# EAGLE design Control Board (EAGLE 9.1.0)
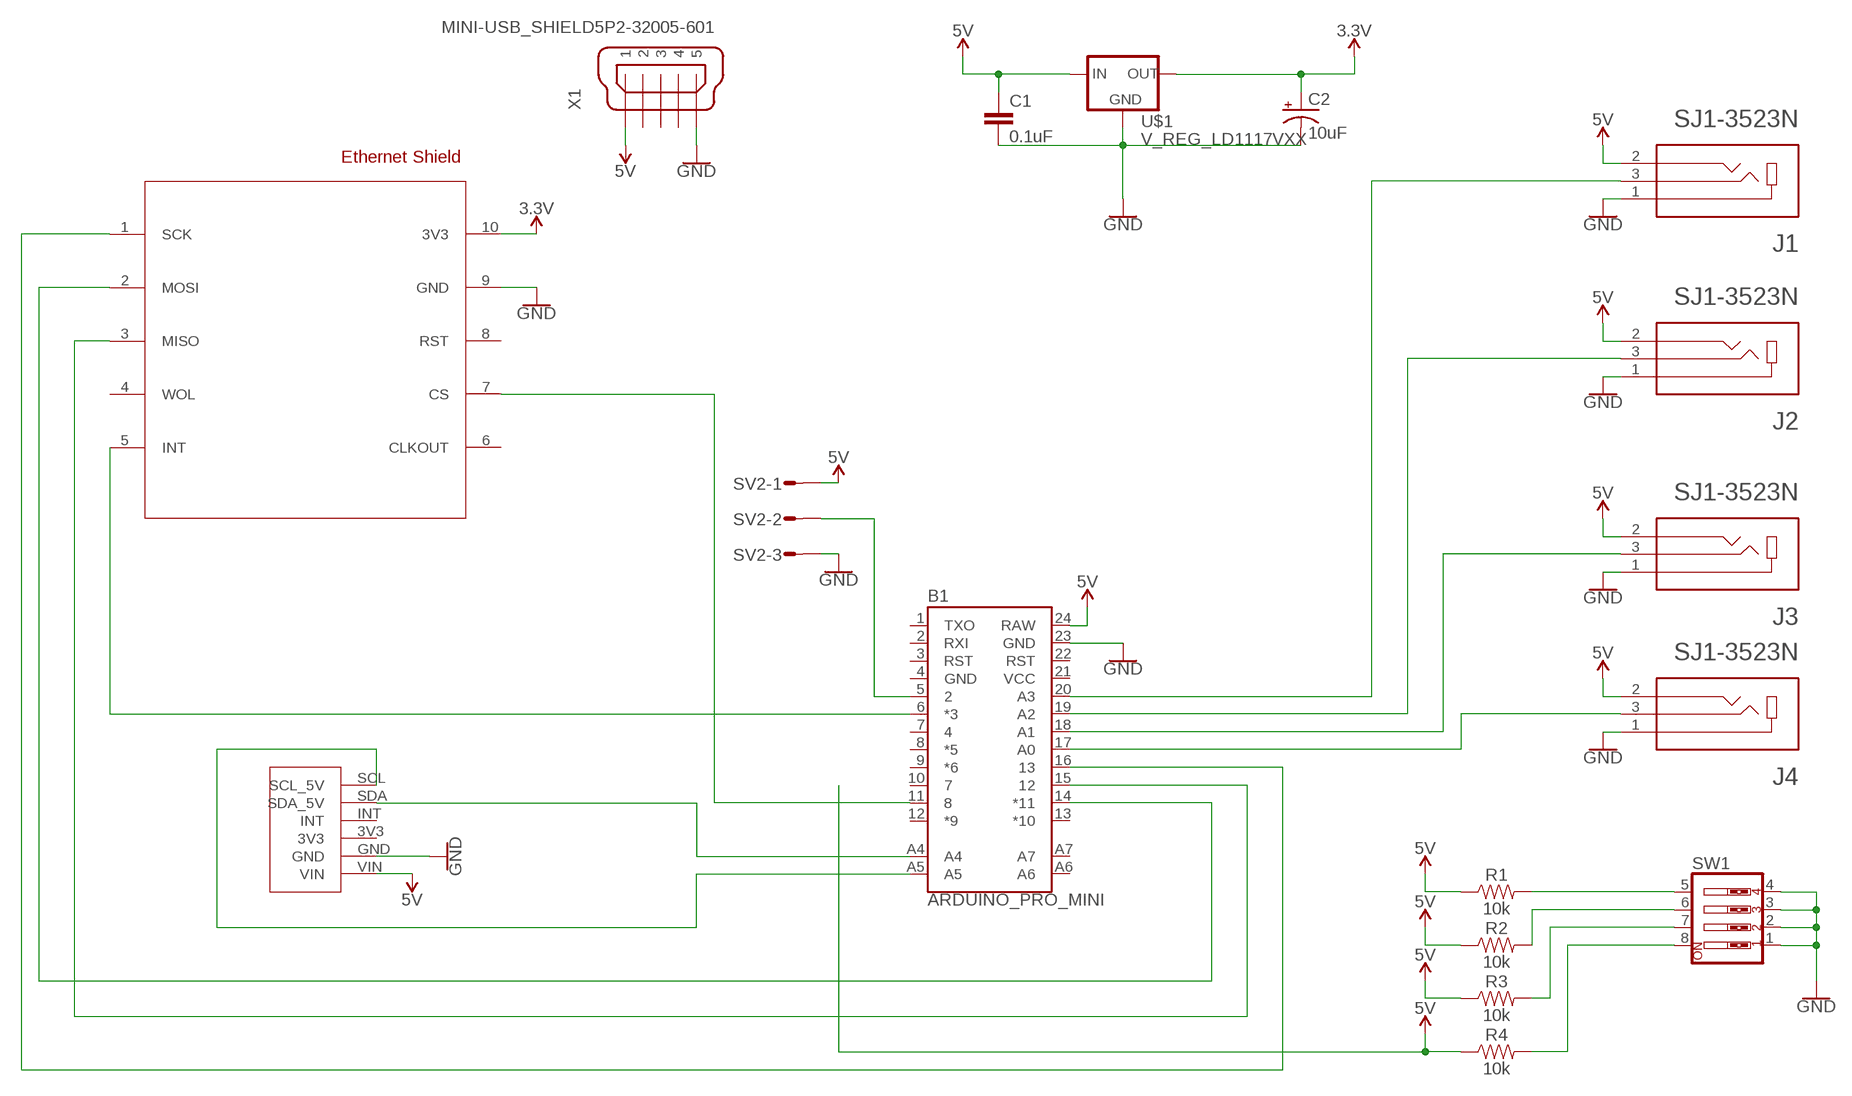
[diagram p0: schematic, sheet 1]

## Parts
B1  ARDUINO_PRO_MINI  [ARDUINO_PRO_MINI]
C1  0.1uF  0.1UF-KIT-EZ-50V-20%  [CAP-PTH-SMALL-KIT]
C2  10uF  10UF-POLAR-RADIAL-2.5MM-25V-20%  [CPOL-RADIAL-2.5MM-5MM]
J1  SJ1-3523N  [CUI_SJ1-3523N]
J2  SJ1-3523N  [CUI_SJ1-3523N]
J3  SJ1-3523N  [CUI_SJ1-3523N]
J4  SJ1-3523N  [CUI_SJ1-3523N]
R1  10k  10KOHM-0603-1/10W-1%  [0603]
R2  10k  10KOHM-0603-1/10W-1%  [0603]
R3  10k  10KOHM-0603-1/10W-1%  [0603]
R4  10k  10KOHM-0603-1/10W-1%  [0603]
SV2  MT6-3  [MT6-3]
SW1  SW_DIP-4  [EDG-04]
U$1  V_REG_LD1117VXX  [78XXL]
U$2  ENC28J60-H  [ENC28J60-H]
U$3  TSL2591  [TSL2591]
X1  MINI-USB_SHIELD5P2-32005-601  [32005-601]

## Nets
3.3V: C2.1(+) U$1.GND(OUT) U$2.10(3V3)
5V: B1.24(RAW) C1.1 J1.2 J2.2 J3.2 J4.2 R1.1 R2.1 R3.1 R4.1 SV2.1 U$1.OUT(IN) U$3.VIN X1.1
GND: B1.23(GND) C1.2 C2.2(-) J1.1 J2.1 J3.1 J4.1 SV2.3 SW1.1 SW1.2 SW1.3 SW1.4 U$1.IN(GND) U$2.9(GND) U$3.GND X1.5
N$1: B1.5 SV2.2
N$2: B1.6(*3) U$2.5(INT)
N$3: B1.20(A3) J1.3
N$4: B1.19(A2) J2.3
N$5: B1.18(A1) J3.3
N$6: B1.17(A0) J4.3
N$7: B1.16 U$2.1(SCK)
N$8: B1.15 U$2.3(MISO)
N$9: B1.14(*11) U$2.2(MOSI)
N$10: B1.11 U$2.7(CS)
N$11: B1.A4 U$3.SDA(SDA_5V)
N$12: B1.A5 U$3.SCL(SCL_5V)
N$13: R1.2 SW1.5
N$14: R2.2 SW1.6
N$15: R3.2 SW1.7
N$16: R4.2 SW1.8
Unconnected: B1.1(TXO) B1.2(RXI) B1.3(RST) B1.7 B1.8(*5) B1.9(*6) B1.10 B1.12(*9) B1.13(*10) B1.22(RST) B1.A6 B1.A7 U$2.4(WOL) U$2.6(CLKOUT) U$2.8(RST) U$3.3V3 U$3.INT X1.2 X1.3 X1.4 X1.M1(S1) X1.M2(S2)

## Power pins joined to a net without a drawn wire
GND: B1.4(GND)
VCC: B1.21(VCC)

## Library data of the parts
B1 = SparkFun-Boards:ARDUINO_PRO_MINI: SparkFun Pro Mini Pro Mini compatible footprint. Dimensions: 0.7 x 1.3" PCB Thickness: 0.8mm SparkFun Products: 3.3V/8MHz <https://www.sparkfun.com/products/11114> 5V/16MHz <https://www.sparkfun.com/products/11113>
C1 = SparkFun-Capacitors:0.1UF: 0.1µF ceramic capacitors A capacitor is a passive two-terminal electrical component used to store electrical energy temporarily in an electric field.; PROD_ID: CAP-08370
C2 = SparkFun-Capacitors:10UF-POLAR: 10.0µF polarized capacitors A capacitor is a passive two-terminal electrical component used to store electrical energy temporarily in an electric field.; PROD_ID: CAP-08440
J1-J4 = SJ1-3523N:SJ1-3523N: 3.5 mm Right-Angle Stereo Jack, 3 Pin PCB Mount, Non-Threaded; MANUFACTURER: CUI; PARTREV: 1.02; STANDARD: Manufacturer recommendation
R1-R4 = SparkFun-Resistors:10KOHM: 10kΩ resistor A resistor is a passive two-terminal electrical component that implements electrical resistance as a circuit element. Resistors act to reduce current flow, and, at the same time, act to lower voltage levels within circuits. - Wikipedia; PROD_ID: RES-00824
SV2 = con-amp-mt6:MT6-3: AMP MT6 CONNECTOR; OC_FARNELL: unknown; OC_NEWARK: unknown
SW1 = special:SW_DIP-4: DIP SWITCH
U$1 = SparkFun-IC-Power:V_REG_LD1117VXX: LD1117VXX voltage regulator. We carry the 3.3V version (COM-00526) in TO-220 package.
U$2 = Ethernet Shield:ENC28J60-H
U$3 = TSL2591:TSL2591
X1 = con-cypressindustries:MINI-USB_SHIELD5P2-: MINI USB-B R/A DIP 5pol. Source: www.cypressindustries.com; OC_FARNELL: unknown; OC_NEWARK: unknown

## Board
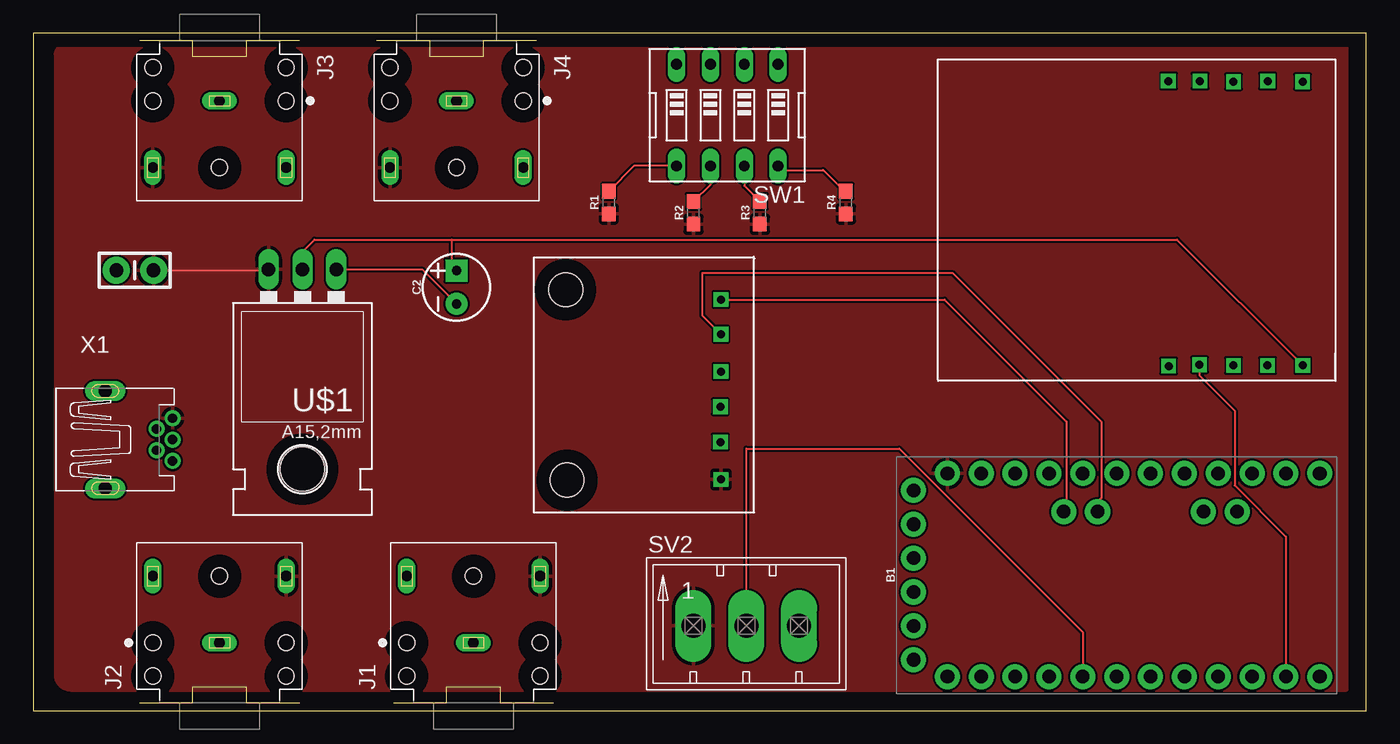
[diagram p1: board, top side]
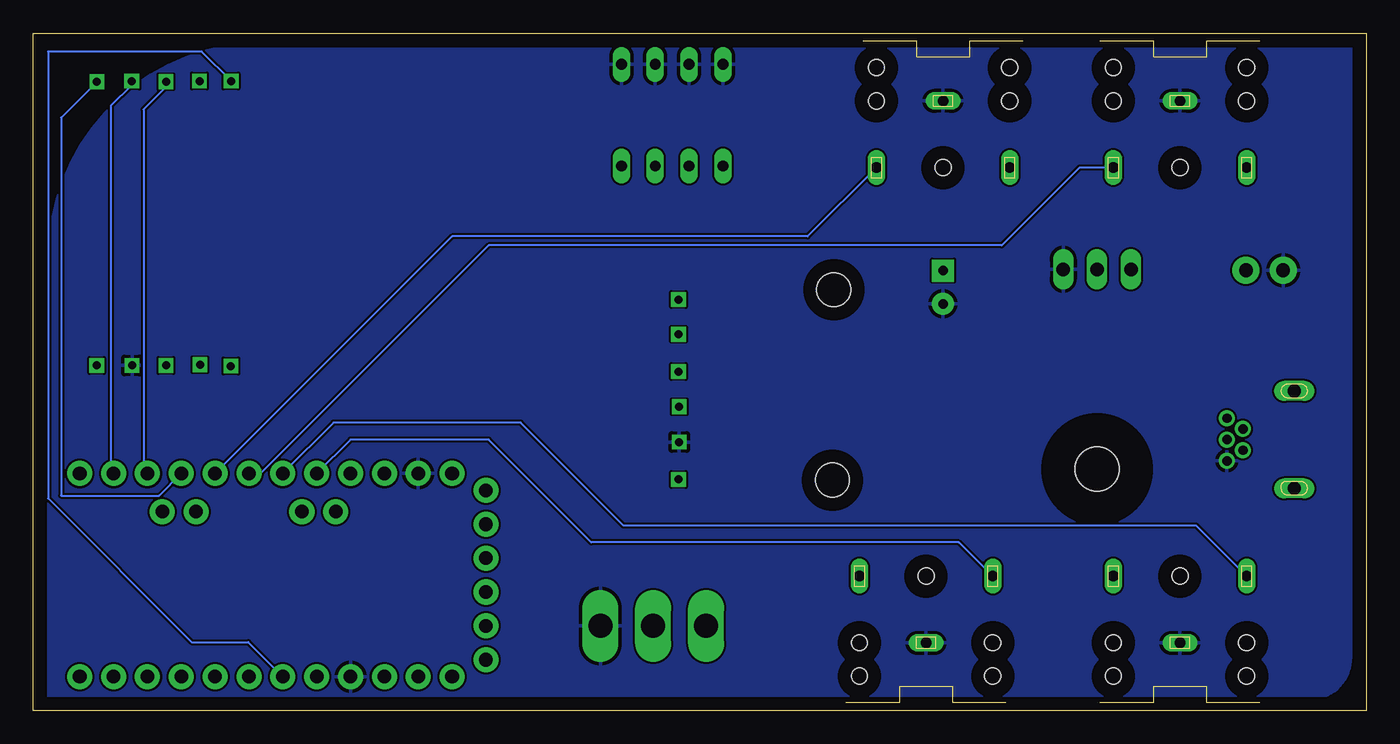
[diagram p2: board, bottom side, seen from below]

Size 100 x 50.79 mm. Coordinates in mm from the lower left corner, seen from the top.
Outline: 0,0 100,0 100,50.79 0,50.79 0,0
Copper layers (1*16): Top 0.035mm / dielectric 1.5mm / Bottom 0.035mm
Design rules "default": minimum track width 6mil, minimum drill 0.35mm, track to track 6mil, track to pad 6mil, pad to pad 6mil, via to via 6mil, smd to smd 6mil, copper to edge 40mil, drill to drill 6mil, minimum pad ring 10mil, minimum via ring 8mil, stop-mask expansion 4mil, vias tented up to drill 0mil, thermal gap 10mil

### Footprints (pad centres in the part's own frame; a part is rotated, then mirrored left to right if it is on the bottom)
ARDUINO_PRO_MINI = drill 1.016 pad 1.88: 1 -7.62,12.7; 2 -7.62,10.16; 3 -7.62,7.62; 4 -7.62,5.08; 5 -7.62,2.54; 6 -7.62,0; 7 -7.62,-2.54; 8 -7.62,-5.08; 9 -7.62,-7.62; 10 -7.62,-10.16; 11 -7.62,-12.7; 12 -7.62,-15.24; 13 7.62,-15.24; 14 7.62,-12.7; 15 7.62,-10.16; 16 7.62,-7.62; 17 7.62,-5.08; 18 7.62,-2.54; 19 7.62,0; 20 7.62,2.54; 21 7.62,5.08; 22 7.62,7.62; 23 7.62,10.16; 24 7.62,12.7; A4 4.763,1.429; A5 4.763,3.969; A6 4.763,-9.049; A7 4.763,-6.509; BLK -6.35,15.24; GND -3.81,15.24; GRN 6.35,15.24; RXI 1.27,15.24; TXO 3.81,15.24; VCC -1.27,15.24
CAP-PTH-SMALL-KIT = drill 1.016 pad 2.032: 1 -1.397,0; 2 1.397,0
CPOL-RADIAL-2.5MM-5MM = drill 0.7 pad 1.651 square: 1 1.25,0 | drill 0.7 pad 1.651: 2 -1.25,0
CUI_SJ1-3523N = drill 0.8 long: 1 0,0; 2 5,-5; 3 5,5 | hole 1.2: -2.5,5; 0,5; 5,0; -2.5,-5; 0,-5
0603 = smd 1.1 x 1: 1 -0.85,0; 2 0.85,0
MT6-3 = drill 1.803 long: 1 2.54,0; 2 6.502,0; 3 10.465,0
EDG-04 = drill 0.813 long: 1 -3.81,-3.81; 2 -1.27,-3.81; 3 1.27,-3.81; 4 3.81,-3.81; 5 3.81,3.81; 6 1.27,3.81; 7 -1.27,3.81; 8 -3.81,3.81
78XXL = drill 1.016 long: GND 0,-3.81; IN -2.54,-3.81; OUT 2.54,-3.81 | hole 3.302: 0,11.176
ENC28J60-H = drill 0.6 square: 1 2.565,-10.335; 2 5.181,-10.385; 3 7.746,-10.335; 4 10.261,-10.385; 5 12.625,-10.385; 6 12.608,10.997; 7 10.298,10.9; 8 7.748,10.949; 9 5.197,10.949; 10 2.551,10.949
TSL2591 = drill 0.6 square: 3V3 -1.349,-5.826; GND -3.995,-5.826; INT 1.297,-5.878; SCL 6.692,-5.878; SDA 4.097,-5.878; VIN -6.796,-5.878 | hole 2.54: 7.419,5.772; -6.847,5.668
32005-601 = drill 0.7 pad 1.016: 1 2.825,1.6; 2 1.625,0.8; 3 2.825,0; 4 1.625,-0.8; 5 2.825,-1.6 | drill 1 pad 1.422 long: M1 -2.225,3.65; M2 -2.225,-3.65

### Placement (x,y rotation side)
B1  81.28,10.16 90 top
C1  7.62,33.02 180 top
C2  31.75,31.75 90 top
J1  33.02,5.08 90 top
J2  13.97,5.08 90 top
J3  13.97,45.72 270 top
J4  31.75,45.72 270 top
R1  43.18,38.1 90 top
R2  49.53,37.33 90 top
R3  54.51,37.33 90 top
R4  60.96,38.1 90 top
SV2  46.99,6.35 0 top
SW1  52.07,44.65 180 top
U$1  20.19,29.28 180 top
U$2  97.79,36.83 180 top
U$3  45.72,24.13 90 top
X1  7.62,20.32 0 top

### Tracks (layer width: path | path; a pad name or v marks a point on that pad's centre or on a via)
3.3V
  Top 0.152: U$1.GND 20.19,34.41 21.09,35.31 31.4,35.31 | 31.4,35.31 85.81,35.31 U$2.10 | C2.1 arc-90 31.4,33.35 31.4,35.31
5V
  Top 0.152: C1.1 17.58,33.02 U$1.OUT
  pour Top: 98.5,1.5 arc90 98.6,1.6 98.6,49.7 arc90 98.3,50 2.4,50 arc90 2.3,49.9 arc90 1.6,49.2 1.6,2.7 arc90 2.8,1.5
GND
  Top 0.152: U$1.IN 29.16,33.09 C2.2
  pour Bottom: 1.1,50.2 82.7,50.1 arc-90 98.9,33.9 98.9,1 arc-90 98.8,0.9 arc-90 98.7,0.8 4.3,0.8 arc-90 1.1,4
N$1
  Top 0.152: SV2.2 53.49,19.64 64.98,19.64 78.74,5.88 B1.5
N$2
  Bottom 0.152: B1.6 83.88,5.14 88.12,5.14 98.9,15.92 98.9,49.41 87.36,49.41 U$2.5
N$3
  Bottom 0.152: J1.3 30.56,12.62 58.14,12.62 65.84,20.32 76.2,20.32 B1.20
N$4
  Bottom 0.152: B1.19 77.47,21.59 63.44,21.59 55.74,13.89 12.78,13.89 J2.3
N$5
  Bottom 0.152: B1.18 82.93,17.78 65.83,34.88 27.34,34.88 21.51,40.72 J3.3
N$6
  Bottom 0.152: J4.3 41.91,35.56 68.58,35.56 B1.17
N$7
  Bottom 0.152: U$2.1 97.92,44.47 97.92,16.11 90.57,16.11 B1.16
N$8
  Bottom 0.152: U$2.3 90.04,46.77 91.72,45.08 91.72,18.07 B1.15
N$9
  Bottom 0.152: B1.14 94.18,17.98 94.18,45.35 92.61,46.91 U$2.2
N$10
  Top 0.152: B1.11 93.98,13.04 90.13,16.89 90.13,22.49 87.49,25.13 U$2.7
N$11
  Top 0.152: U$3.SDA 50.2,29.63 50.2,32.83 68.95,32.83 80.13,21.64 80.13,15.95 79.85,15.67 B1.A4
N$12
  Top 0.152: U$3.SCL 68.36,30.82 77.51,21.67 77.51,15.12 B1.A5
N$13
  Top 0.152: SW1.5 45.07,40.84 R1.2
N$14
  Top 0.152: SW1.6 50.8,39.45 R2.2
N$15
  Top 0.152: SW1.7 53.34,39.35 R3.2
N$16
  Top 0.152: R4.2 60.85,38.95 59.25,40.55 59.24,40.54 56.18,40.54 SW1.8